# EasyEDA schematic SCH_stm32f103c8t6_test1_2023-07-15.json
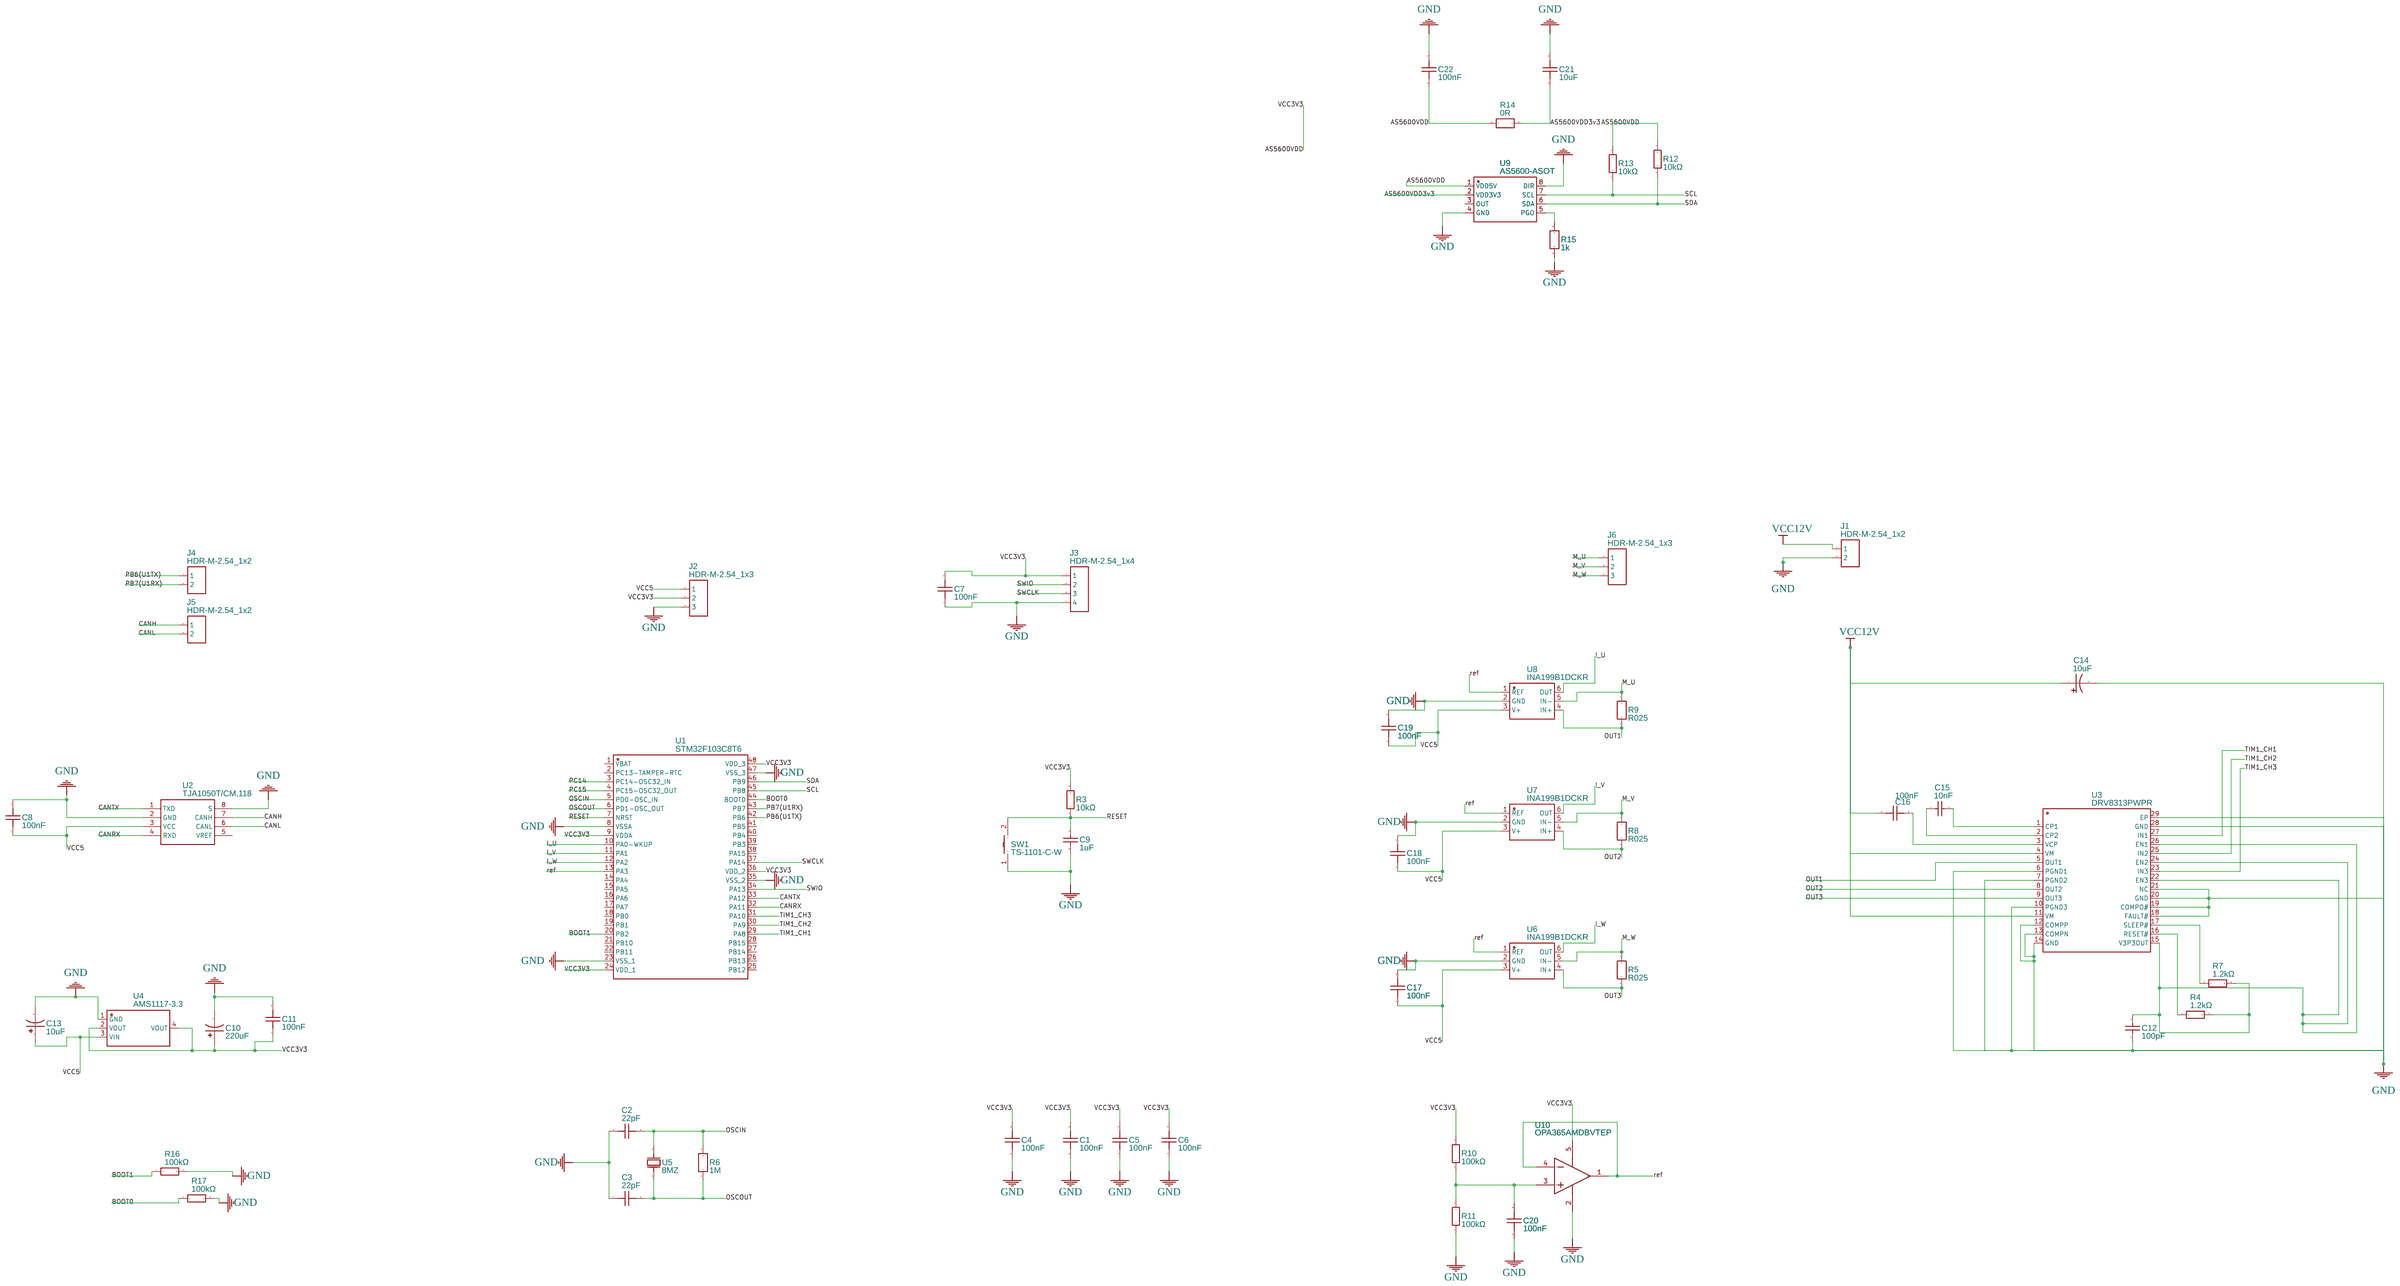
[diagram p0: schematic sheet]

## Parts
C1  100nF  [C0603]
C2  22pF  [C0603]
C3  22pF  [C0603]
C4  100nF  [C0603]
C5  100nF  [C0603]
C6  100nF  [C0603]
C7  100nF  [C0603]
C8  100nF  [C0603]
C9  1uF  [C0603]
C10  220uF  [CASE-C_6032]
C11  100nF  [C0603]
C12  100pF  [C0603]
C13  10uF  [CASE-A_3216]
C14  10uF  [CAP-TH_BD5.0-P2.00-D0.8-FD]
C15  10nF  [C0603]
C16  100nF  [C0603]
C17  100nF  [C0603]
C18  100nF  [C0603]
C19  100nF  [C0603]
C20  100nF  [C0603]
C21  10uF  [C0603]
C22  100nF  [C0603]
J1  HDR-M-2.54_1x2  [HDR-M-2.54_1X2]
J2  HDR-M-2.54_1x3  [HDR-M-2.54_1X3]
J3  HDR-M-2.54_1x4  [HDR-M-2.54_1X4]
J4  HDR-M-2.54_1x2  [HDR-M-2.54_1X2]
J5  HDR-M-2.54_1x2  [HDR-M-2.54_1X2]
J6  HDR-M-2.54_1x3  [HDR-M-2.54_1X3]
R3  10kΩ  [R0603]
R4  1.2kΩ  [R0402]
R5  R025  [R2512]
R6  1M  [R0603]
R7  1.2kΩ  [R0402]
R8  R025  [R2512]
R9  R025  [R2512]
R10  100kΩ  [R0603]
R11  100kΩ  [R0603]
R12  10kΩ  [R0603]
R13  10kΩ  [R0603]
R14  0R  [R0603]
R15  1k  [R0603]
R16  100kΩ  [R0603]
R17  100kΩ  [R0603]
SW1  TS-1101-C-W  [SW-SMD_L6.0-W3.3-LS8.0]
U1  STM32F103C8T6  [LQFP-48_L7.0-W7.0-P0.50-LS9.0-BL]
U2  TJA1050T/CM,118  [SOIC-8_L5.0-W4.0-P1.27-LS6.0-BL]
U3  DRV8313PWPR  [HTSSOP-28_L9.8-W4.5-P0.65-LS6.6-BL-EP]
U4  AMS1117-3.3  [SOT-223-3_L6.5-W3.4-P2.30-LS7.0-BR]
U5  8MZ  [HC-49S_L11.0-W4.4-P4.88]
U6  INA199B1DCKR  [SC-70-6_L2.0-W1.3-P0.65-LS2.1-BR]
U7  INA199B1DCKR  [SC-70-6_L2.0-W1.3-P0.65-LS2.1-BR]
U8  INA199B1DCKR  [SC-70-6_L2.0-W1.3-P0.65-LS2.1-BR]
U9  AS5600-ASOT  [SOIC-8_L5.0-W4.0-P1.27-LS6.0-BL]
U10  OPA365AMDBVTEP  [SOT-23-5_L2.9-W1.6-P0.95-LS2.8-BR]

## Library data of the parts
C1-C8 C11 C20-C22 = C_0603_US: Contributor: LCEDA_Lib
C9 = CGA3E1X7R1E105KT0Y0E: Supplier: LCSC; Supplier Part: C76708; Manufacturer: TDK; Contributor: LCSC; JLCPCB Part Class: Extended Part
C10 = C_Tan_SMD_C_US: Contributor: LCEDA_Lib
C12 = CGA3E2C0G2A101JT0Y0N: Supplier: LCSC; Supplier Part: C342908; Manufacturer: TDK; Contributor: LCSC; JLCPCB Part Class: Extended Part
C13 = C_Tan_SMD_A_US: Contributor: LCEDA_Lib
C14 = NXA50VB10M5*11_LO: Supplier: LCSC; Supplier Part: C346966; Manufacturer: SamYoung Electronics; Contributor: LCSC; Paste Type: expand
C15 = CGA3E2C0G1H103JT0Y0N: Supplier: LCSC; Supplier Part: C76710; Manufacturer: TDK; Contributor: LCSC; Paste Type: expand
C16-C19 = 0603B104K500: Supplier: LCSC; Manufacturer: WTC; Supplier Part: C90807; Paste Type: expand
J1 J4 J5 = HDR-M-2.54_1x2: Supplier Part: C124375; Supplier: LCSC; Contributor: LCEDA_Lib
J2 J6 = HDR-M-2.54_1x3: Supplier Part: C180248; Supplier: LCSC; Contributor: LCEDA_Lib
J3 = HDR-M-2.54_1x4: Supplier Part: C124378; Supplier: LCSC; Contributor: LCEDA_Lib
R3 R12 R13 = 0603WAF1002T5E: Supplier: LCSC; Manufacturer: UNI-ROYAL(厚声); Supplier Part: C25804; Resistance (Ohms): 10K; JLCPCB Part Class: Basic Part
R4 R7 = RMC04021.2K1%N: Supplier: LCSC; Supplier Part: C325417; Manufacturer: Tyohm(幸亚电阻); Resistance (Ohms): 1.2K; Contributor: LCSC; JLCPCB Part Class: Extended Part
R5 R8 R9 = R_2512_EU: Contributor: LCEDA_Lib
R6 R14 R15 = R_0603_EU: Contributor: LCEDA_Lib
R10 R11 R16 R17 = AR03DTDX1003: Supplier: LCSC; Supplier Part: C319966; Manufacturer: Viking(光颉); Contributor: LCSC; Resistance (Ohms): 100K; JLCPCB Part Class: Extended Part
SW1 = TS-1101-C-W: Supplier: LCSC; Supplier Part: C318938; Manufacturer: XKB Connectivity(中国星坤); Contributor: LCSC; JLCPCB Part Class: Extended Part
U1 = STM32F103C8T6: Supplier: LCSC; Manufacturer: ST(意法半导体); Supplier Part: C8734; JLCPCB Part Class: Basic Part
U2 = TJA1050T/CM,118: Supplier: LCSC; Manufacturer: NXP(恩智浦); Supplier Part: C6952; JLCPCB Part Class: Basic Part
U3 = DRV8313PWPR: Supplier: LCSC; Supplier Part: C92482; Manufacturer: Texas Instruments; Contributor: LCSC; Paste Type: expand
U4 = AMS1117-3.3: sourceId: dwIGgezVh; Supplier: LCSC; Manufacturer: AMS; Supplier Part: C6186; JLCPCB Part Class: Basic Part
U5 = S1C39321XWJAC: Supplier: LCSC; Supplier Part: C2764489; Manufacturer: JYJE(晶友嘉); Contributor: LCSC
U6-U8 = INA199B1DCKR: Supplier: LCSC; Supplier Part: C398920; Manufacturer: TI(德州仪器); Contributor: LCSC; JLCPCB Part Class: Extended Part
U9 = AS5600-ASOT: Supplier: LCSC; Supplier Part: C499458; Manufacturer: ams(艾迈斯半导体); Contributor: LCSC; JLCPCB Part Class: Extended Part
U10 = OPA365AMDBVTEP: Supplier: LCSC; Supplier Part: C2862994; Manufacturer: TI(德州仪器); link: https://atta.szlcsc.comnull; Contributor: lcsc

## Nets
GND: C1.1 C2.1 C3.1 C4.1 C5.1 C6.1 C7.1 C8.2 C9.2 C10.2 C11.2 C12.2 C13.2 C14.2 C17.2 C18.2 C19.2 C20.1 C21.2 C22.2 J1.2 J2.3 J3.4 R11.1 R15.1 R16.2 R17.2 SW1.1 U1.8(VSSA) U1.23(VSS_1) U1.35(VSS_2) U1.47(VSS_3) U2.2(GND) U2.8(S) U3.6(PGND1) U3.7(PGND2) U3.10(PGND3) U3.12(COMPP) U3.13(COMPN) U3.14(GND) U3.18(FAULT#) U3.19(COMPO#) U3.20(GND) U3.21(NC) U3.28(GND) U3.29(EP) U4.1(GND) U6.2(GND) U7.2(GND) U8.2(GND) U9.4(GND) U9.8(DIR) U10.2(V-)
VCC5: C8.1 C13.1 C17.1 C18.1 C19.1 J2.1 U2.3(VCC) U4.3(VIN) U6.3(V+) U7.3(V+) U8.3(V+)
VCC12V: C14.1 C16.1 J1.1 U3.4(VM) U3.11(VM)
AS5600VDD: C1.2 C4.2 C5.2 C6.2 C7.2 C10.1 C11.1 C22.1 J2.2 J3.1 R3.2 R10.2 R12.2 R13.2 R14.1 U1.9(VDDA) U1.24(VDD_1) U1.36(VDD_2) U1.48(VDD_3) U4.2(VOUT) U4.4(VOUT) U9.1(VDD5V) U10.5(V+)
AS5600VDD3v3: C21.1 R14.2 U9.2(VDD3V3)
BOOT0: R17.1 U1.44(BOOT0)
BOOT1: R16.1 U1.20(PB2)
CANH: J5.1 U2.7(CANH)
CANL: J5.2 U2.6(CANL)
CANRX: U1.32(PA11) U2.4(RXD)
CANTX: U1.33(PA12) U2.1(TXD)
I_U: U1.10(PA0-WKUP) U8.6(OUT)
I_V: U1.11(PA1) U7.6(OUT)
I_W: U1.12(PA2) U6.6(OUT)
M_U: J6.1 R9.1 U8.5(IN-)
M_V: J6.2 R8.1 U7.5(IN-)
M_W: J6.3 R5.1 U6.5(IN-)
OSCIN: C2.2 R6.2 U1.5(PD0-OSC_IN) U5.2(OSC2)
OSCOUT: C3.2 R6.1 U1.6(PD1-OSC_OUT) U5.1(OSC1)
OUT1: R9.2 U3.5(OUT1) U8.4(IN+)
OUT2: R8.2 U3.8(OUT2) U7.4(IN+)
OUT3: R5.2 U3.9(OUT3) U6.4(IN+)
PB6(U1TX): J4.1 U1.42(PB6)
PB7(U1RX): J4.2 U1.43(PB7)
PC14: U1.3(PC14-OSC32_IN)
PC15: U1.4(PC15-OSC32_OUT)
ref: U1.13(PA3) U6.1(REF) U7.1(REF) U8.1(REF) U10.1(VOUT) U10.4(-IN)
RESET: C9.1 R3.1 SW1.2 U1.7(NRST)
SCL: R13.1 U1.45(PB8) U9.7(SCL)
SDA: R12.1 U1.46(PB9) U9.6(SDA)
SWCLK: J3.3 U1.37(PA14)
SWIO: J3.2 U1.34(PA13)
TIM1_CH1: U1.29(PA8) U3.27(IN1)
TIM1_CH2: U1.30(PA9) U3.25(IN2)
TIM1_CH3: U1.31(PA10) U3.23(IN3)
Net-(C12-1): C12.1 R4.2 R7.2 U3.15(V3P3OUT) U3.22(EN3) U3.24(EN2) U3.26(EN1)
Net-(C15-1): C15.1 U3.2(CP2)
Net-(C15-2): C15.2 U3.1(CP1)
Net-(C16-2): C16.2 U3.3(VCP)
Net-(C20-2): C20.2 R10.1 R11.2 U10.3(+IN)
Net-(R4-1): R4.1 U3.16(RESET#)
Net-(R7-1): R7.1 U3.17(SLEEP#)
Net-(R15-2): R15.2 U9.5(PGO)

Not connected (* = marked no-connect by the designer): U1 1(VBAT) 2(PC13-TAMPER-RTC) 14(PA4) 15(PA5) 16(PA6) 17(PA7) 18(PB0) 19(PB1) 21(PB10) 22(PB11) 25(PB12) 26(PB13) 27(PB14) 28(PB15) 38(PA15) 39(PB3) 40(PB4) 41(PB5); U2 5(VREF); U9 3(OUT)
